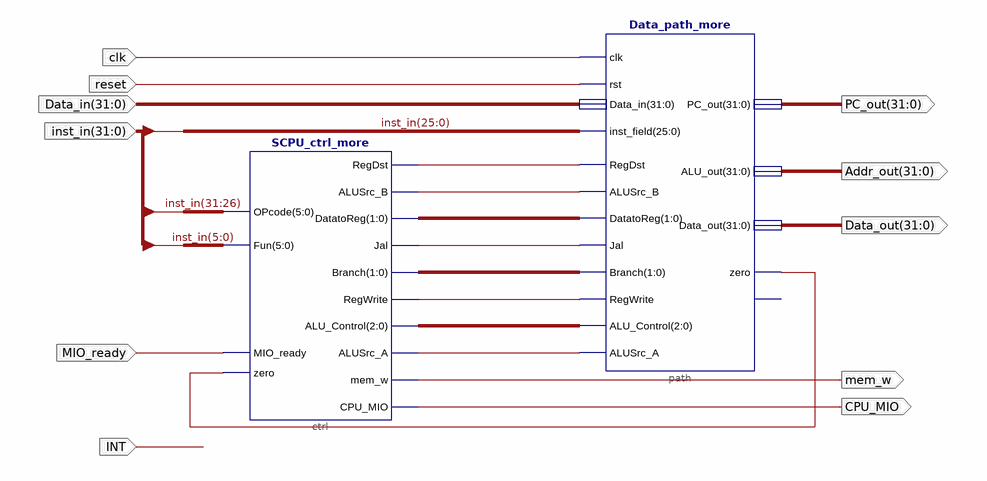
[diagram p0: schematic sheet 1]
// Xilinx ISE schematic SCPU_More.sch (kintex7) as structural Verilog: 2 symbols, 11 ports
module SCPU_More (
  input  MIO_ready,
  input  INT,
  input  clk,
  input  reset,
  input  [31:0] Data_in,
  input  [31:0] inst_in,
  output [31:0] Data_out,
  output [31:0] Addr_out,
  output [31:0] PC_out,
  output CPU_MIO,
  output mem_w
);

  wire ALUSrc_A, ALUSrc_B, Jal, RegDst, RegWrite, zero;
  wire [1:0] Branch, DatatoReg;
  wire [2:0] ALU_Control;

  Data_path_more path (
    .Branch(Branch), .clk(clk), .rst(reset), .ALU_Control(ALU_Control), .ALUSrc_B(ALUSrc_B),
    .RegWrite(RegWrite), .RegDst(RegDst), .Jal(Jal), .inst_field(inst_in[25:0]), .DatatoReg(DatatoReg),
    .Data_in(Data_in), .PC_out(PC_out), .zero(zero), .ALU_out(Addr_out), .Data_out(Data_out),
    .ALUSrc_A(ALUSrc_A));  // open: overflow
  SCPU_ctrl_more ctrl (
    .RegDst(RegDst), .ALUSrc_B(ALUSrc_B), .DatatoReg(DatatoReg), .Jal(Jal), .ALU_Control(ALU_Control),
    .Fun(inst_in[5:0]), .OPcode(inst_in[31:26]), .Branch(Branch), .RegWrite(RegWrite), .MIO_ready(MIO_ready),
    .zero(zero), .CPU_MIO(CPU_MIO), .ALUSrc_A(ALUSrc_A), .mem_w(mem_w));
endmodule
